# Altium schematic sheet SAM_E54_Xplained_Pro_MCU_Peripherals.SchDoc: Target MCU Peripherals
size A3; Organization: Microchip Norway; Address1: Vestre Rosten 79; Address2: N-7075 TILLER; Address3: NORWAY; DocumentNumber: A09-2748; Revision: 5; SheetNumber: 4; SheetTotal: 13; DrawnBy: Microchip Norway; Engineer: HN; PageSetup: Record=PageOptions|CenterHorizontal=True|CenterVertical=True|PrintScale=1.01|XCorrection=1.00|YCorrection=1.00|PrintKind=1|BorderSize=5000000|LeftOffset=0|BottomOffset=0|Orientation=2|PaperLength=1000|PaperWidth=1000|Scale=100|PaperSource=7|PrintQuality=-4|MediaType=1|DitherType=10|PaperKind=A3 (297 x 420 mm)|PrintScaleMode=1; ProjectTitle: SAM E54 Xplained Pro; PCBNumber: A08-2643; PCBRevision: 3; ProjectName: SAM E54 Xplained Pro
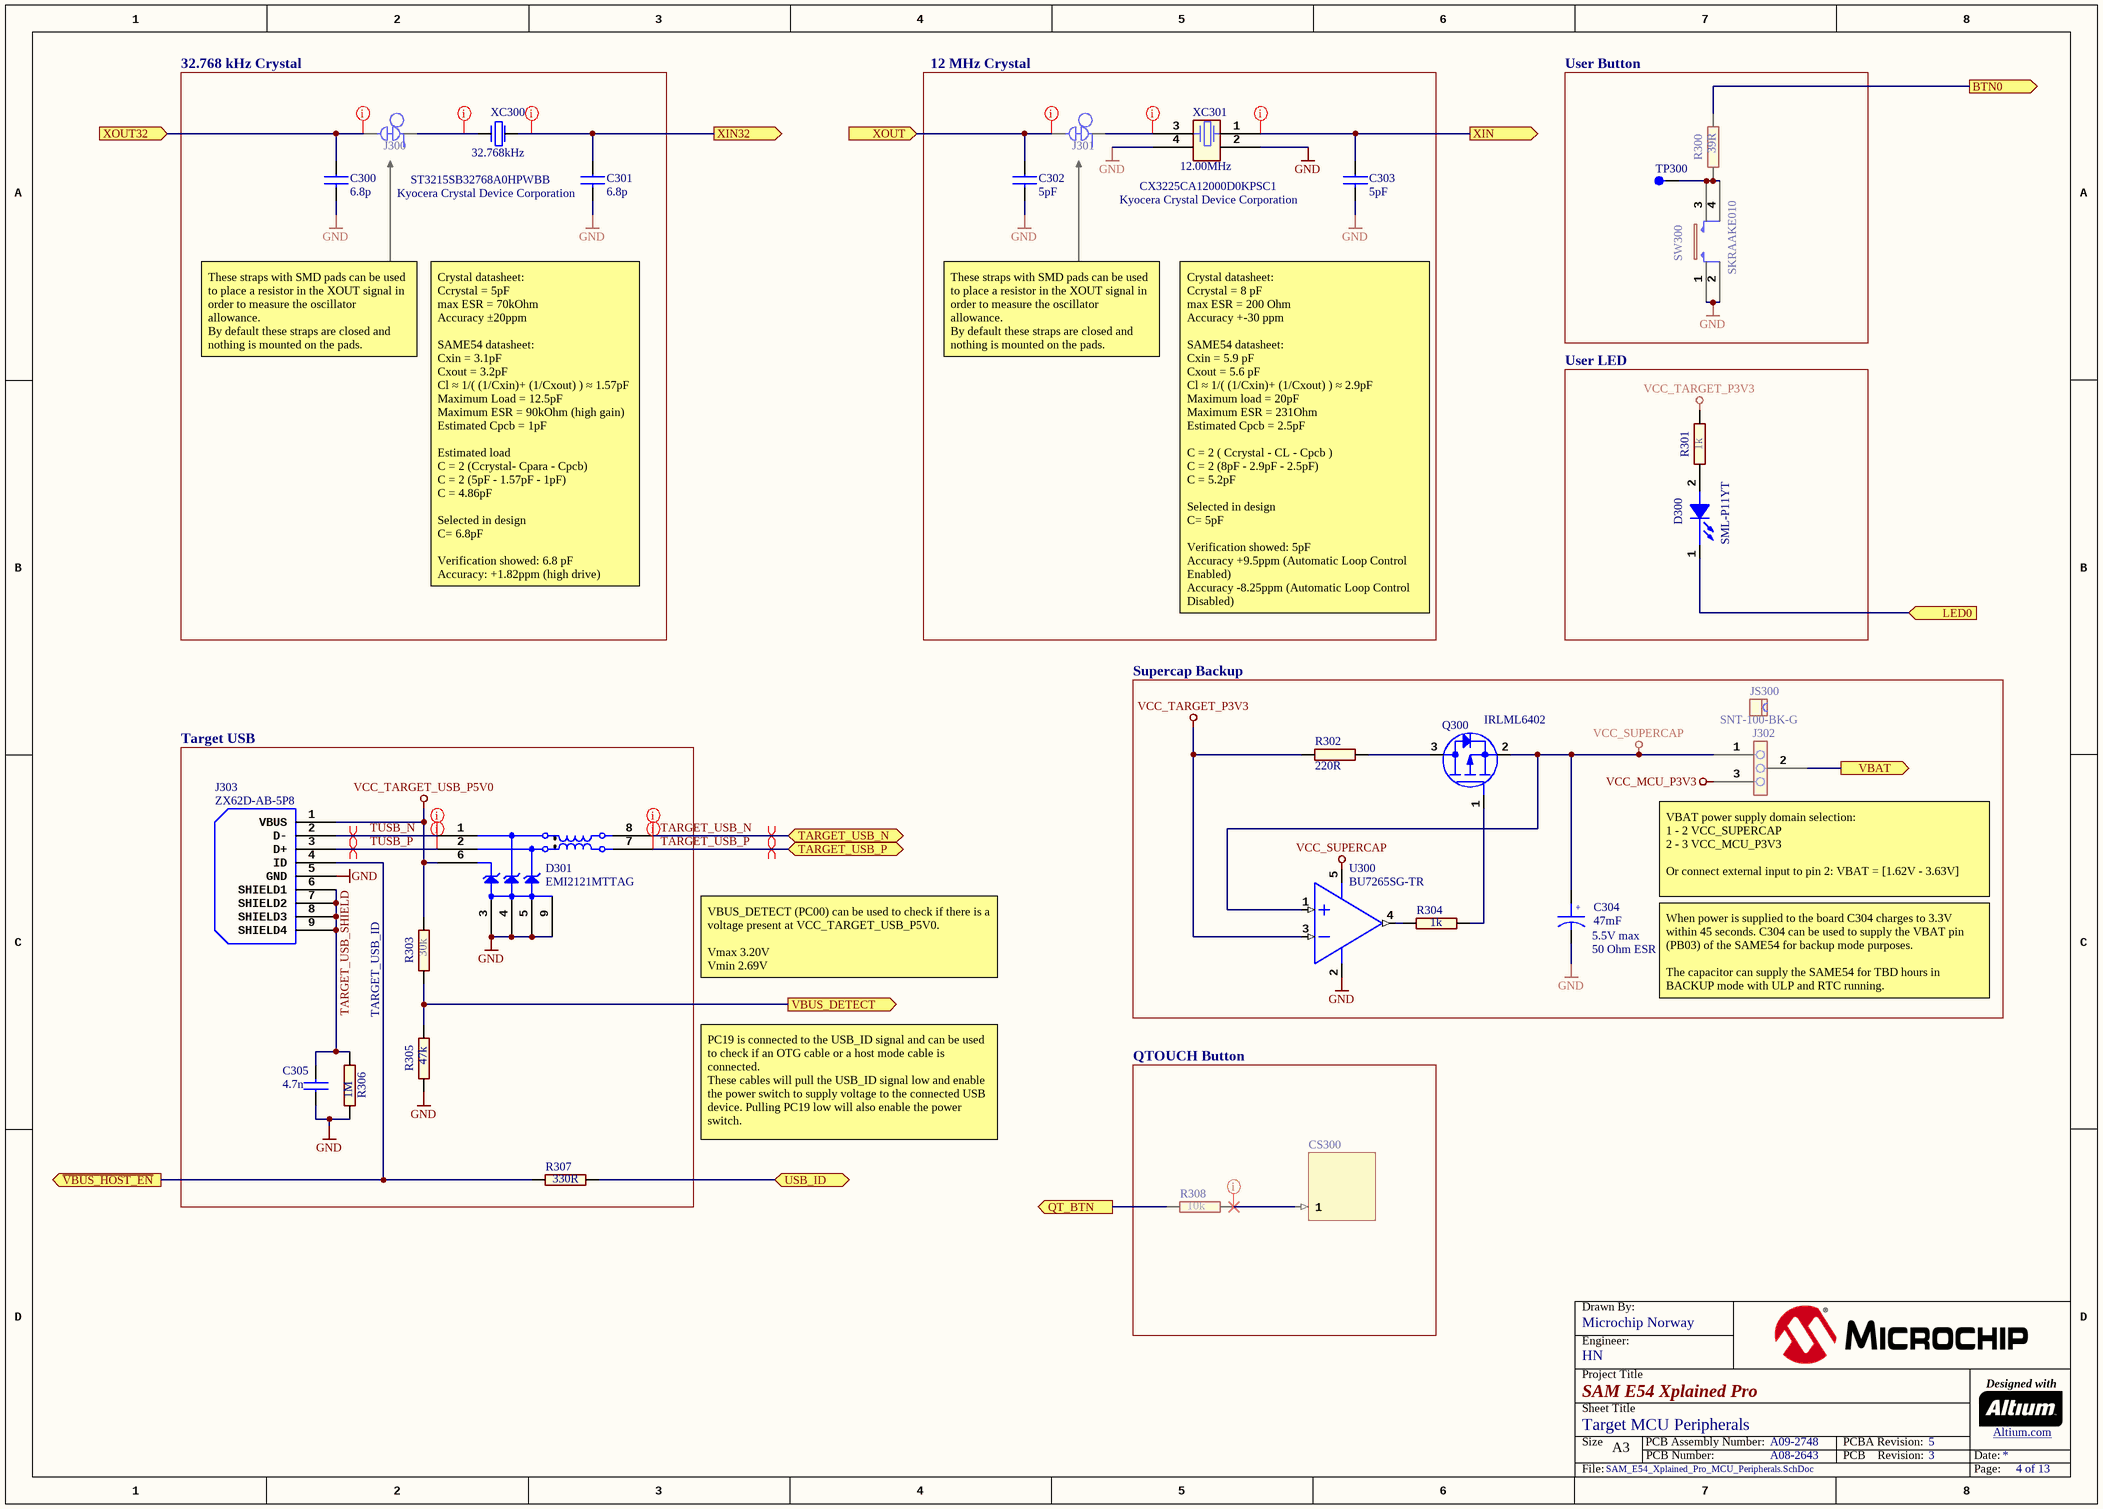
[diagram p0: SAM_E54_Xplained_Pro_MCU_Peripherals.SchDoc]

## Parts
C300  value 6.8p  [AP1-00053]  (hidden comment: *)
C301  value 6.8p  [AP1-00053]  (hidden comment: *)
C302  value 5pF  [AP1-00053]
C303  value 5pF  [AP1-00053]
C304  value 47mF  [AP1-00122]
C305  value 4.7n  [AP1-00053]
CS300  (no value)  (no BOM)
D300  value SML-P11YT  [AP4-00160]
D301  value EMI2121MTTAG  [AP4-00159]
J300  (no value)  [AP9-00044]  (net tie, no BOM)
J301  (no value)  [AP9-00044]  (net tie, no BOM)
J302  (no value)  [AP8-00745]
J303  value ZX62D-AB-5P8  [AP8-00852]
JS300  value SNT-100-BK-G  [AP8-00525]
Q300  value IRLML6402  [AP5-00002]
R300  value 39R  [AP2-00011]
R301  value 1k  [AP2-00011]
R302  value 220R  [AP2-00011]
R303  value 30k  [AP2-00011]
R304  value 1k  [AP2-00011]
R305  value 47k  [AP2-00011]
R306  value 1M  [AP2-00011]
R307  value 330R  [AP2-00011]
R308  value 10k  [AP2-00011]
SW300  value SKRAAKE010  [AP8-00137]
TP300  (no value)  [AP8-00010]  (no BOM)
U300  value BU7265SG-TR  [AP6-00087]
XC300  value 32.768kHz  Manufacturer: Kyocera Crystal Device Corporation  MPN: ST3215SB32768A0HPWBB  [AP7-00090]  (hidden comment: *)
XC301  value 12.00MHz  Manufacturer: Kyocera Crystal Device Corporation  MPN: CX3225CA12000D0KPSC1  [AP7-00089]

## Blocks framed on the sheet
32.768 kHz Crystal: C300 C301 J300 XC300
12 MHz Crystal: C302 C303 J301 XC301
User Button: R300 SW300 TP300
User LED: D300 R301
Supercap Backup: C304 J302 JS300 Q300 R302 R304 U300
Target USB: C305 D301 J303 R303 R305-R307
QTOUCH Button: CS300 R308

## Ports
BTN0 (out), LED0 (in), QT_BTN (out), TARGET_USB_N (bidir), TARGET_USB_P (bidir), USB_ID (bidir), VBAT (out), VBUS_DETECT (out), XIN32 (out), XIN (out), XOUT32 (in), XOUT (in), ~{VBUS_HOST_EN} (out)

## Nets
GND: C300.2 C301.2 C302.2 C303.2 C304.2 C305.1 D301.3(GND) D301.4(GND) D301.5(GND) D301.9(GND) J303.5(GND) R305.1 R306.1 SW300.1 SW300.2 U300.2(GND) XC301.2 XC301.4
VCC_MCU_P3V3: J302.3
VCC_SUPERCAP: C304.1 J302.1 Q300.2(S) U300.1(IN+) U300.5(VCC)
VCC_TARGET_P3V3: R301.2 R302.1 U300.3(IN-)
VCC_TARGET_USB_P5V0: D301.6(VBUS) J303.1(VBUS) R303.2
BTN0: R300.2 ; port BTN0
LED0: D300.1(CATHODE) ; port LED0
QT_BTN: R308.2 ; port QT_BTN
TARGET_USB_N: D301.8(DIFF1_INT) ; port TARGET_USB_N
TARGET_USB_P: D301.7(DIFF2_INT) ; port TARGET_USB_P
TARGET_USB_SHIELD: C305.2 J303.6(SHIELD1) J303.7(SHIELD2) J303.8(SHIELD3) J303.9(SHIELD4) R306.2
TUSB_N: D301.1(DIFF1_EXT) J303.2(D-)
TUSB_P: D301.2(DIFF2_EXT) J303.3(D+)
USB_ID: R307.2 ; port USB_ID
~{VBUS_HOST_EN}: J303.4(ID) R307.1 ; port ~{VBUS_HOST_EN}
VBAT: J302.2 ; port VBAT
VBUS_DETECT: R303.1 R305.2 ; port VBUS_DETECT
XIN: C303.1 XC301.1 ; port XIN
XIN32: C301.1 XC300.1 ; port XIN32
XOUT: C302.1 J301.2 ; port XOUT
XOUT32: C300.1 J300.2 ; port XOUT32
NetCS300_1: CS300.1 R308.1
NetD300_2: D300.2(ANODE) R301.1
NetJ300_1: J300.1 XC300.2
NetJ301_1: J301.1 XC301.3
NetQ300_1: Q300.1(G) R304.2
NetQ300_3: Q300.3(D) R302.2
NetR300_1: R300.1 SW300.3 SW300.4 TP300.1
NetR304_1: R304.1 U300.4(OUT)

## Layout directives
differential pair: TARGET_USB_N, TARGET_USB_P, TUSB_N, TUSB_P
rule Assembly Testpoint Usage [Testpoint - Not Allowed    Multiple - Not Allowed]; rule Fabrication Testpoint Usage [Testpoint - Not Allowed    Multiple - Not Allowed]: NetJ300_1, NetJ301_1, TARGET_USB_N, TARGET_USB_P, TUSB_N, TUSB_P, XIN, XIN32, XOUT, XOUT32
rule Assembly Testpoint Usage [Testpoint - Not Allowed    Multiple - Not Allowed]; net class QTouch: NetCS300_1

## Notes on the sheet
- These straps with SMD pads can be used to place a resistor in the XOUT signal in order to measure the oscillator allowance.
  By default these straps are closed and nothing is mounted on the pads.
- Crystal datasheet:
  Ccrystal = 5pF
  max ESR = 70kOhm
  Accuracy ±20ppm
  SAME54 datasheet:
  Cxin = 3.1pF
  Cxout = 3.2pF
  Cl ≈ 1/( (1/Cxin)+ (1/Cxout) ) ≈ 1.57pF
  Maximum Load = 12.5pF
  Maximum ESR = 90kOhm (high gain)
  Estimated Cpcb = 1pF
  Estimated load
  C = 2 (Ccrystal- Cpara - Cpcb)
  C = 2 (5pF - 1.57pF - 1pF)
  C = 4.86pF
  Selected in design
  C= 6.8pF
  Verification showed: 6.8 pF
  Accuracy: +1.82ppm (high drive)
  Startup time: TBD ms to reach full swing with a TBD pF probe connected to the crystal.
  Safety factor: Above TBD
- Crystal datasheet:
  Ccrystal = 8 pF
  max ESR = 200 Ohm
  Accuracy +-30 ppm
  SAME54 datasheet:
  Cxin = 5.9 pF
  Cxout = 5.6 pF
  Cl ≈ 1/( (1/Cxin)+ (1/Cxout) ) ≈ 2.9pF
  Maximum load = 20pF
  Maximum ESR = 231Ohm
  Estimated Cpcb = 2.5pF
  C = 2 ( Ccrystal - CL - Cpcb )
  C = 2 (8pF - 2.9pF - 2.5pF)
  C = 5.2pF
  Selected in design
  C= 5pF
  Verification showed: 5pF
  Accuracy +9.5ppm (Automatic Loop Control Enabled)
  Accuracy -8.25ppm (Automatic Loop Control Disabled)
  Startup: full swing after TBDµs (first clock after TBDµs)
  Safety factor: Above TBD
- (near J302) VBAT power supply domain selection:
  1 - 2 VCC_SUPERCAP
  2 - 3 VCC_MCU_P3V3
  Or connect external input to pin 2: VBAT = [1.62V - 3.63V]
- VBUS_DETECT (PC00) can be used to check if there is a voltage present at VCC_TARGET_USB_P5V0.
  Vmax 3.20V
  Vmin 2.69V
- (near C304) 5.5V max
- (near C304) 50 Ohm ESR
- When power is supplied to the board C304 charges to 3.3V within 45 seconds. C304 can be used to supply the VBAT pin (PB03) of the SAME54 for backup mode purposes.
  The capacitor can supply the SAME54 for TBD hours in BACKUP mode with ULP and RTC running.
- TARGET_USB_ID
- PC19 is connected to the USB_ID signal and can be used to check if an OTG cable or a host mode cable is connected.
  These cables will pull the USB_ID signal low and enable the power switch to supply voltage to the connected USB device. Pulling PC19 low will also enable the power switch.
- Drawn By:
- Project Title
- Engineer:
- Designed with
- Sheet Title
- Size
- A3
- PCB Number:
- PCB Assembly Number:
- PCBA Revision:
- PCB    Revision:
- Date:
- Altium.com <http://go.altium.com/MicrochipLandingPage_Evaluation.html>
- File:
- Page:
- (in symbol A01-0732) +

## Library data of the parts
C300 C301 = A01-0013: Ceramic capacitor, SMD 0402, NP0, 50V, +/-5%; PartGroup: Capacitors,Ceramic,SMD 0402; Manufacturer: YAGEO CORP; MPN: CC0402CRNPO9BN6R8; TemperatureRange: -55 - +125 deg C; AN: A01-0013; Tolerance: 50V, +/-5%; Height: 0,550000011920929
C302 C303 = A01-0783: Ceramic capacitor, SMD 0402, NP0, 50V, +/-0.25pF; PartGroup: Capacitors,Ceramic,SMD 0402; Manufacturer: Murata; MPN: GRM1555C1H5R0CA01D; TemperatureRange: -55 to 125C; AN: A01-0783; Tolerance: +/-0.25pF; Height: 0,550000011920929
C304 = A01-0732: Electric Double-Layer (Supercapacitor), 5.5V, 47mF, SMD, 10.5mm diameter, 50Î© ESR; PartGroup: Capacitors,Other; Manufacturer: Kemet; MPN: FC0H473ZFTBR24; Tolerance: -20/+80%; TemperatureRange: -25Â°C to +70Â°C; AN: A01-0732; Height: 5,5
C305 = A01-0046: Ceramic capacitor, SMD 0402, X7R, 25V, +/-10%; PartGroup: Capacitors,Ceramic,SMD 0402; Manufacturer: PHYCOMP; MPN: 2238 587 15632; TemperatureRange: -55 - +125 deg C; AN: A01-0046; Tolerance: 25V, +/-10%; Height: 0,550000011920929
CS300 = QTouchButton: QTouch Button; ConfiguratorName: ATMEL_TOUCH; ConfigurationParameters: {}__sensorid[1]{}width[8]{}height[8]{}
D300 = A10-0182: LED, SMD 0402, Yellow, Wave length=586nm, 7.6mcd @ (1mA, 1.9Vf); PartGroup: Opto,LEDs,SMD; Manufacturer: ROHM; MPN: SML-P11YT-T86; TemperatureRange: -40 to +85; AN: A10-0182; Height: 0,200000002980232
D301 = A04-0195: EMI2121, SZEMI2121 Single Pair Common Mode Filter with ESD Protection; PartGroup: Diodes,Transient suppression; Manufacturer: ON Semiconductor; TemperatureRange: âˆ’40 to +85 Â°C; AN: A04-0195; Height: 0,800000011920929; MPN: EMI2121MTTAG
J300 J301 = A09-0783: Default closed SMD strap, 0603 size; PartGroup: Mechanical devices,PCB implemented components; Value: SMD-STRAP_0603_CLOSED; AN: A09-0783; Height: 0
J302 = A08-1799: 1x3 pin header, 2.54mm pitch, Pin-in-Paste THM, 1mm hole; PartGroup: Mechanical devices,Connectors,Pin headers; Manufacturer: SAMTEC; Value: HMTSW-103-23-F-S-237; AN: A08-1799; Height: 6,09999990463257; MPN: HMTSW-103-23-F-S-237
J303 = A08-2112: Micro USB AB Connector, Standard SMT + DIP; PartGroup: Mechanical devices,Connectors,USB; Manufacturer: HIROSE; MPN: ZX62D-AB-5P8(30); AN: A08-2112; Height: 2,79999995231628
JS300 = A08-0543: Jumper cap for 2.54mm pinheader; PartGroup: Mechanical devices,Mounting accessories,Other; Manufacturer: SAMTEC; AN: A08-0543; MPN: SNT-100-BK-G
Q300 = A05-0087: P-ch. MOSFET. -30V, -3.7A continuous,RDS(ON)=0.05Ohm@VGS=-4,5V, RDS(ON)=0.08Ohm@VGS=-2.5V; PartGroup: Transistors,Power FET,SMD; Manufacturer: International Rectifier; MPN: IRLML6402PBF; TemperatureRange: -55 - +150 deg C; AN: A05-0087; Height: 1,14999997615814
R300 = A02-0178: Thick film resistor, SMD 0402, 1/16W, 1%; PartGroup: Resistors,SMD,0402 1%; Manufacturer: ASJ; MPN: CR10-39R0-FK; TemperatureRange: -55 - +125 deg C; AN: A02-0178; Tolerance: 1 %; Height: 0,349999994039536
R301 R304 = A02-0212: Thick film resistor, SMD 0402, 1/16W, 1%; PartGroup: Resistors,SMD,0402 1%; Manufacturer: ASJ; MPN: CR10-1001-FK; TemperatureRange: -55 - +125 deg C; AN: A02-0212; Tolerance: 1 %; Height: 0,349999994039536
R302 = A02-0196: Thick film resistor, SMD 0402, 1/16W, 1%; PartGroup: Resistors,SMD,0402 1%; Manufacturer: ASJ; MPN: CR10-2200-FK; TemperatureRange: -55 - +125 deg C; AN: A02-0196; Tolerance: 1 %; Height: 0,349999994039536
R303 = A02-0247: Thick film resistor, SMD 0402, 1/16W, 1%; PartGroup: Resistors,SMD,0402 1%; Manufacturer: ASJ; MPN: CR10-3002-FK; TemperatureRange: -55ï¿½ to +155ï¿½C; AN: A02-0247; Tolerance: 1 %; Height: 0,349999994039536
R305 = A02-0252: Thick film resistor, SMD 0402, 1/16W, 1%; PartGroup: Resistors,SMD,0402 1%; Manufacturer: KOA; MPN: RK73H1ETTP4702F; TemperatureRange: -55 - +125 deg C; AN: A02-0252; Tolerance: 1 %; Height: 0,349999994039536
R306 = A02-0284: Thick film resistor, SMD 0402, 1/16W, 1%; PartGroup: Resistors,SMD,0402 1%; Manufacturer: ASJ; MPN: CR10-1004-FK; TemperatureRange: -55 - +125 deg C; AN: A02-0284; Tolerance: 1 %; Height: 0,349999994039536
R307 = A02-0200: Thick film resistor, SMD 0402, 1/16W, 1%; PartGroup: Resistors,SMD,0402 1%; Manufacturer: ASJ; MPN: CR10-3300-FK; TemperatureRange: -55 - +125 deg C; AN: A02-0200; Tolerance: 1 %; Height: 0,349999994039536
R308 = A02-0236: Thick film resistor, SMD 0402, 1/16W, 1%; PartGroup: Resistors,SMD,0402 1%; Manufacturer: vishay; MPN: CRCW040210K0FKED; TemperatureRange: -55 - +125 deg C; AN: A02-0236; Tolerance: 1 %; Height: 0,349999994039536
SW300 = A08-0790: 6.2x6.2 mm SMD tact switch, same as A08-0091 but less force is needed; PartGroup: Mechanical devices,Switches,SMD; Manufacturer: ALPS; TemperatureRange: -30 - +90 deg C; AN: A08-0790; Height: 5,09999990463257; MPN: SKRAAKE010
TP300 = A08-0004: Single SMD testpad; PartGroup: Mechanical devices,Connectors,Test points; AN: A08-0004; Height: 0; Value: TESTPAD
U300 = A06-1322: Single, Low Voltage (1.8-5.5V), Low Power (0.35ÂµA), low cost; PartGroup: Integrated Circuits,General linear,OP-AMP; Manufacturer: ROHM; TemperatureRange: -40Â°C to +105Â°C; AN: A06-1322; Height: 1,25; MPN: BU7265SG-TR
XC300 = A07-0152: Kyocera ST3215SB32768A0HPWBB, 32.768kHz, 5pF, SMD tuning fork crystal; PartGroup: Frequency devices,Crystals,SMD; Tolerance: Â±20ppm; TemperatureRange: -40Â°C to +85Â°C; AN: A07-0152; Height: 0,800000011920929
XC301 = A07-0150: Kyocera CX3225CA, 12MHz, 8pF, AEC-Q200, SMD crystal; PartGroup: Frequency devices,Crystals,SMD; Tolerance: Â±30ppm; TemperatureRange: -40Â°C to +85Â°C; AN: A07-0150; Height: 0,800000011920929